# Altium schematic sheet COVER PAGE.SchDoc: COVER PAGE
size A4; Revision: 1.0; SheetNumber: 1; SheetTotal: 9
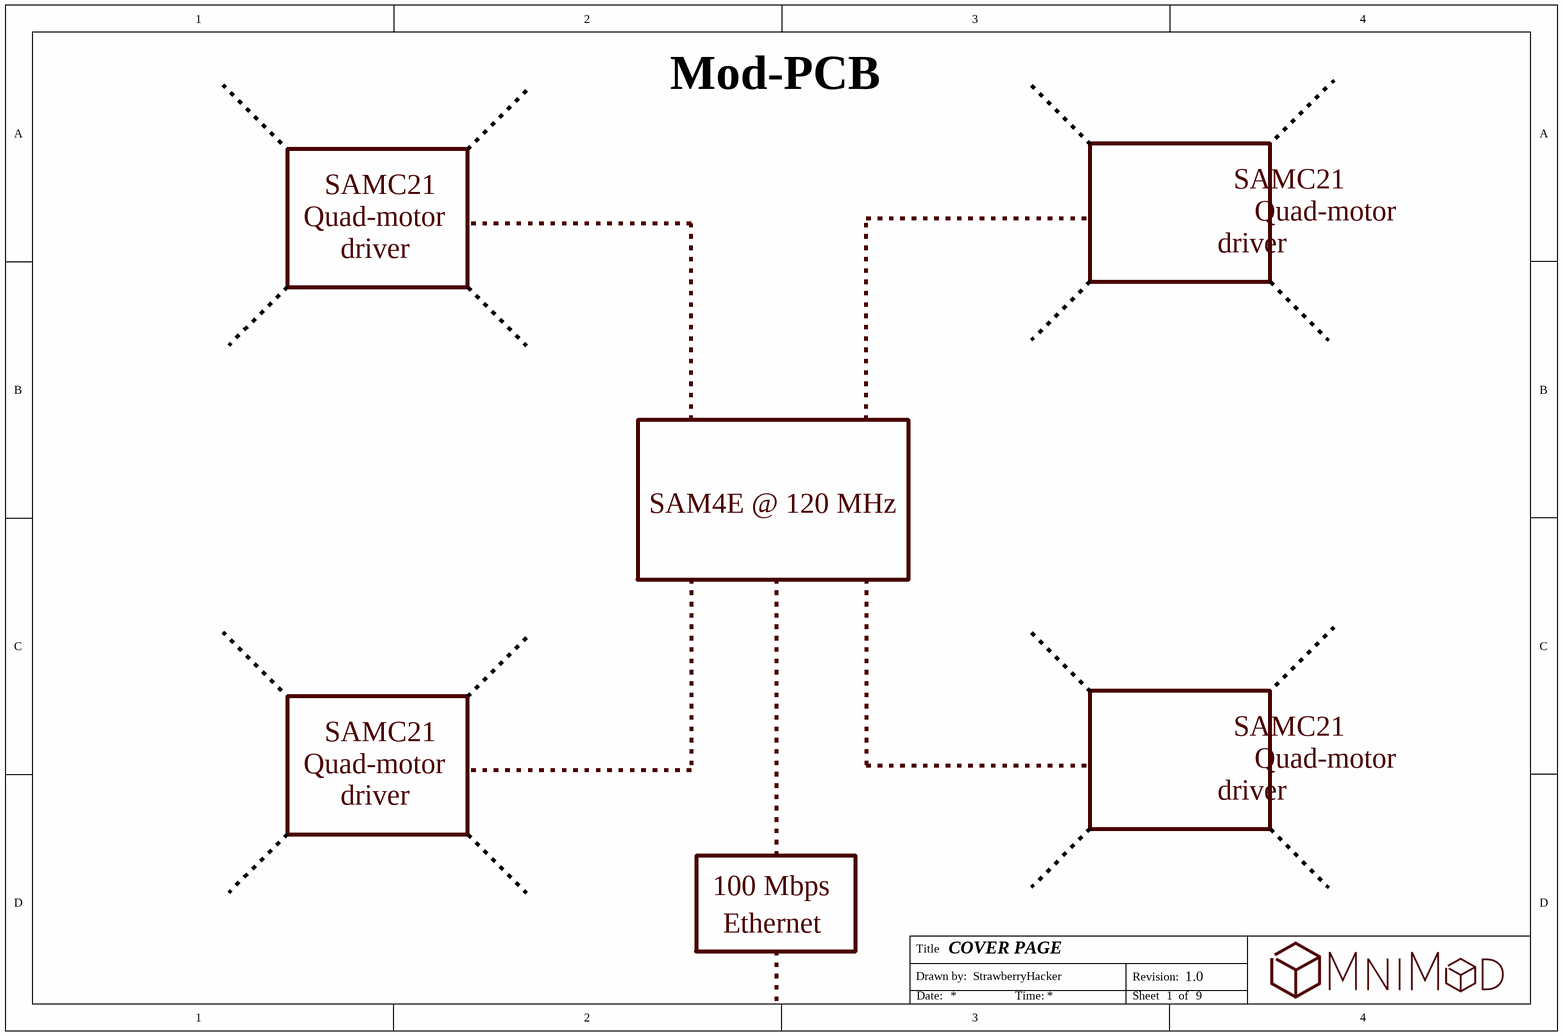
[diagram p0: COVER PAGE.SchDoc]

## Notes on the sheet
- Mod-PCB
- Quad-motor
- SAMC21
- driver
- SAM4E @ 120 MHz
- 100 Mbps
- Ethernet
- Title
- Drawn by:
- StrawberryHacker
- Revision:
- Date:
- Time:
- Sheet
- of